# EAGLE design esp-lis3dh (EAGLE 8.4.1)
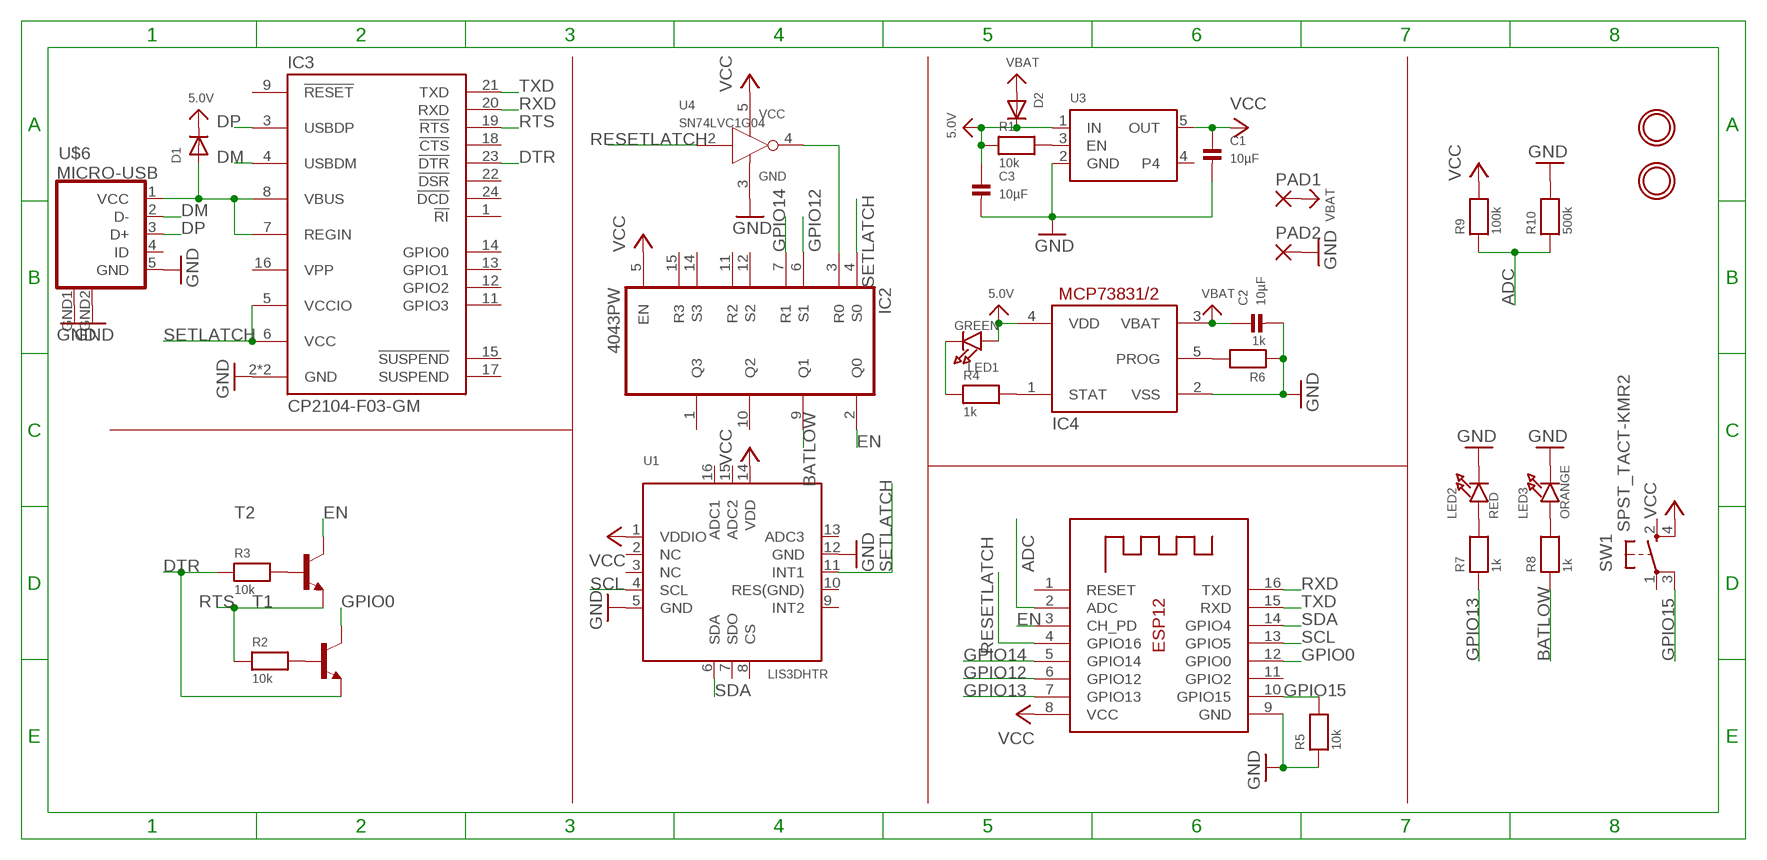
[diagram p0: schematic, sheet 1]

## Parts
C1  10µF  CAP_CERAMIC0805  [0805]
C2  10µF  CAP_CERAMIC0805  [0805]
C3  10µF  CAP_CERAMIC0805  [0805]
D1  DIODESOD-123  [SOD-123]
D2  DIODESOD-123  [SOD-123]
IC2  4043PW  [TSSOP16]
IC3  CP2104-F03-GM  [QFN24-PAD]
IC4  MCP73831/OT  [SOT23-5L]
LED1  GREEN  LED0805  [CHIPLED_0805]
LED2  RED  LED0805  [CHIPLED_0805]
LED3  ORANGE  LED0805  [CHIPLED_0805]
PAD1  SMD2  [SMD1,27-2,54]
PAD2  SMD2  [SMD1,27-2,54]
R1  10k  RESISTOR0603  [0603]
R2  10k  RESISTOR0603  [0603]
R3  10k  RESISTOR0603  [0603]
R4  1k  RESISTOR0603  [0603]
R5  10k  RESISTOR0603  [0603]
R6  1k  RESISTOR0603  [0603]
R7  1k  RESISTOR0603  [0603]
R8  1k  RESISTOR0603  [0603]
R9  100k  RESISTOR0603  [0603]
R10  500k  RESISTOR0603  [0603]
SW1  SPST_TACT-KMR2  [KMR2]
T1  MMBT2222ALT1-NPN-SOT23-BEC  [SOT23-BEC]
T2  MMBT2222ALT1-NPN-SOT23-BEC  [SOT23-BEC]
U1  LIS3DHTR  ACCEL_LIS3DHTR  [LGA16_3X3MM]
U3  VREG_SOT23-5  [SOT23-5]
U4  SN74LVC1G04  [SOT23-5]
U$6  MICRO-USB  [MICRO-USB]
U$7  MOUNTINGHOLE2.5  [MOUNTINGHOLE_2.5_PLATED]
U$8  MOUNTINGHOLE2.5  [MOUNTINGHOLE_2.5_PLATED]
X1  ESP-12  [ESP-12]

## Nets
5.0V: C3.1 D1.C D2.C IC4.4(VDD) LED1.A R1.1 U3.1(IN)
ADC: R9.1 R10.1 X1.2(ADC)
BATLOW: IC2.9(Q1) R8.1
DM: IC3.4(USBDM) U$6.2(D-)
DP: IC3.3(USBDP) U$6.3(D+)
DTR: IC3.23(!DTR) R3.1 T1.E
EN: IC2.2(Q0) T2.C X1.3(CH_PD)
GND: C1.2 C2.2 C3.2 IC3.2(GND) IC3.TP(GND) IC4.2(VSS) LED2.C LED3.C PAD2.1(P) R5.1 R6.1 R10.2 U1.5(GND) U1.12(GND) U3.2(GND) U4.3(GND) U$6.5(GND) U$6.GND1(GND) U$6.GND2(GND) X1.9(GND)
GPIO0: T1.C X1.12(GPIO0)
GPIO12: IC2.6(S1) X1.6(GPIO12)
GPIO13: R7.1 X1.7(GPIO13)
GPIO14: IC2.7(R1) X1.5(GPIO14)
GPIO15: R5.2 SW1.3(P1) X1.10(GPIO15)
N$1: IC2.3(R0) U4.4(Y)
N$2: IC4.5(PROG) R6.2
N$3: LED2.A R7.2
N$4: R1.2 U3.3(EN)
N$5: R2.2 T1.B
N$6: IC4.1(STAT) R4.2
N$7: LED3.A R8.2
N$8: LED1.C R4.1
N$9: R3.2 T2.B
N$10: D1.A IC3.7(REGIN) IC3.8(VBUS) U$6.1(VCC)
RESETLATCH: U4.2(A) X1.4(GPIO16)
RTS: IC3.19(!RTS) R2.1 T2.E
RXD: IC3.20(RXD) X1.16(TXD)
SCL: U1.4(SCL) X1.13(GPIO5)
SDA: U1.6(SDA) X1.14(GPIO4)
SETLATCH: IC2.4(S0) IC3.5(VCCIO) IC3.6(VCC) U1.11(INT1)
TXD: IC3.21(TXD) X1.15(RXD)
VBAT: C2.1 D2.A IC4.3(VBAT) PAD1.1(P)
VCC: C1.1 IC2.5(EN) R9.2 SW1.4(S1) U1.1(VDDIO) U1.14(VDD) U3.5(OUT) U4.5(VCC) X1.8(VCC)
Unconnected: IC2.1(Q3) IC2.10(Q2) IC2.11(R2) IC2.12(S2) IC2.14(S3) IC2.15(R3) IC3.1(!RI) IC3.9(!RESET) IC3.11(GPIO3) IC3.12(GPIO2) IC3.13(GPIO1) IC3.14(GPIO0) IC3.15(!SUSPEND) IC3.17(SUSPEND) IC3.18(!CTS) IC3.22(!DSR) IC3.24(!DCD) SW1.1(P) SW1.2(S) U1.2(NC) U1.3(NC) U1.7(SDO) U1.8(CS) U1.9(INT2) U1.10(RES(GND)) U1.13(ADC3) U1.15(ADC2) U1.16(ADC1) U3.4 U$6.4(ID) X1.1(RESET) X1.11(GPIO2)

## Power pins joined to a net without a drawn wire
VCC: IC2.16(VDD)
VPP: IC3.16(VPP)
VSS: IC2.8(VSS)

## Library data of the parts
C1-C3 = microbuilder:CAP_CERAMIC: Ceramic Capacitors 0402 - 0402 Surface Mount Capacitors 16pF 50V 5% [Digikey: 445-4899-2-ND] 18pF 50V 5% [Digikey: 490-1281-2-ND] 22pF 50V 5% [Digikey: 490-1283-2-ND] 68pF 50V 5% [Digikey: 490-1289-2-ND] 0.1uF 10V 10% [Digikey: 490-1318-2-ND] 1.0uF 6.3V 10% [Digikey: 490-1320-2-ND] 0603 - 0603 Surface Mount Capacitors 16 pF 50V 5% [Digikey: 445-5051-2-ND] 22 pF 50V [Digikey: PCC220ACVTR-ND] 33 pF 50V 5% [Digikey: 490-1415-1-ND] 56pF 50V 5% [Digikey: 490-1421-1-ND] 220pF 50V 5% [Digikey: 445-1285-1-ND] 680 pF 50V 2200 pF 50V 5% C0G [Digikey: 445-1297-1-ND] 5600 pF 100V 5% X7R [Digikey: 478-3711-1-ND] 0.1 µF 25V 10% [Digikey: PCC2277TR-ND] 0.22 µF 16V 10% X7R [Digikey: 445-1318-1-ND] 1.0 µF 25V 10% [Digikey: 445-5146-2-ND] 0603 - RF Specific 3pF 250V +/-0.1pF RF [Digikey: 712-1347-1-ND] 18 pF 250V 5% [Digikey: 478-3505-1-ND or 712-1322-1-ND] 56 pF 250V 5% C0G RF [Digikey: 490-4867-1-ND] 68 pF 250V RF [Digikey: 490-4868-1-ND] 0805 - 0805 Surface Mount Capacitors 220 pF 250V 2% RF Ceramic Capacitor [Digikey: 712-1398-1-ND] 1000 pF 50V 2% NP0 Ceramic Capacitor [Digikey: 478-3760-1-ND] 0.1 µF 25V 10% Ceramic Capacitor [Digikey: PCC1828TR-ND] 1.0 µF 16V 10% Ceramic Capacitor[Digikey: 490-1691-2-ND] 10.0 µF 10V 10% Ceramic Capacitor[Digikey: 709-1228-1-ND] 10.0 uF 16V 10% Ceramic Capacitor [Digikey: 478-5165-2-ND] 47 uF 6.3V 20% Ceramic Capacitor [Digikey: 587-1779-1-ND or 399-5506-1-ND] 1206 - 1206 Surface Mount Capacitors 47uF 10V 20% Ceramic Capacitor [Digikey: 490-5528-1-ND or 399-5508-1-ND or 445-6010-1-ND] 100uF 6.3V -20%, +80% Y5V Ceramic Capacitor (Digikey: 490-4512-1-ND, Mouser: 81-GRM31CF50J107ZE1L)
D1 D2 = microbuilder:DIODE: Diode SMA Model Volts Amps Type Vf Vr Digikey # Notes SSA34-E3 40V 3A Schottky 480mV @ 3A 200uA @ 40V SSA34-E3/61TGITR-ND CDBA120-G 20V 1A Schottky 500mV @ 1A 500uA @ 20V 641-1014-6-ND REEL MBRA210 10V 2A Schottky 350mV @ 2A 700uA @ 10V MBRA210LT3 SOD-123 Model Volts Amps Type Vf Vr Order # Notes BAT54T1G 30V 200mA Schottky 800mV @ 200mA 2uA @ 25V BAT54T1GOSTR-ND B0530W 30V 500mA Schottky 430mV @ 500mA 130uA @ 30V B0530W-FDICT-ND REEL MBR120 1A 20V Schottky 340mV @ 1A MBR120VLSFT1GOSCT-ND SOD-323 Model Volts Amps Type Vf Vr Order # Notes PMEG2005EJ 20V 500mA Schottky 355mV @ 500mA 568-4110-1-ND ZLLS410 10V 570mA Schottky 380mV @ 570mA ZLLS410CT-ND 1N4148WS 75V 150mA Silicon/Simple 1V 1N4148WSFSCT-ND REEL SOD-523 Model Volts Amps Type Vf Vr Order # Notes BAT54XV2 30V 200mA Schottky 0.8V @ 100mA BAT54XV2CT-ND TB751S 30V 30mA Schottky RB751S-40TE61CT-ND SOT23-R/W (R = Solder Paste/Reflow Ovens, W = Hand-Soldering) Model Volts Amps Type Vf Vr Order # Notes BAT54FILM 40V 300mA Schottky 497-7162-1-ND
IC2 = masterthesis:4043: Quad 3-state NOR R/S LATCH
IC3 = CP2104:CP2104: Silabs CP2104 USB to UART Bridge; AVAILABILITY: Unavailable; DESCRIPTION: USB to UART Bridge; MF: Silicon Labs; MP: CP2104; PACKAGE: None; PRICE: None
IC4 = adafruit:MCP73831: MCP73831/2 Miniature Single-Cell, Fully Integrated Li-Ion, Li-Polymer Charge Management Controllers. Nice and small simple lipoly charge controller, with adjustable current and status output (LED) http://www.ladyada.net/library/pcb/eaglelibrary.html
LED1-LED3 = microbuilder:LED: LED 0603 - 0603 Surface Mount Package 2mA: Green LED - Low Power (3.9mcd, 2ma, 1.7Vf) - Digikey: 475-2709-2-ND Orange LED - Low Power (9.8mcd, 2ma, 1.8Vf) - Digikey: 475-1194-2-ND Red LED - Low Power (5mcd, 2ma, 1.8Vf) - Digikey: 475-1195-2-ND Yellow LED - Low Power (7mcd, 2ma, 1.8Vf) - Digikey: 475-1196-2-ND 5mA: Blue LED - Low Power (17mcd, 5ma, 2.9Vf) - Digikey: LNJ937W8CRACT-ND 0805 - 0805 Surface Mount Package 2mA: Red LED (8.8mcd, 2mA, 1.8Vf, Clear) - Low Power [Digikey: 475-2510-1-ND] Green LED (5mcd, 2mA, 1.8Vf, Clear) - Low Power [Digikey: 475-2730-1-ND] Yellow LED (11.3mcd, 2mA, 1.8Vf, Clear) - Low Power [Digikey: 475-2555-1-ND] 20mA: Red LED (104mcd, 20mA, Diffused) - LS R976 [Digikey: 475-1278-6-ND] Red LED (12mcd, 20mA, 2.0Vf, Clear) - APT2012EC [Digikey: 754-1128-1-ND] Green LED (15mcd, 20mA, 2.2Vf, Clear) - APT2012GC [Digikey: 754-1131-1-ND] Orange LED (160mcd, 20mA, 2.1Vf, Clear) - APT2012SECK [Digikey: 754-1130-1-ND] 1206 - 1206 Surface Mount Package Green LED (26mcd, 20mA, Diffused) - LG N971 [Digikey: 475-1407-6-ND] Red LED (15mcd, 20mA, Diffused) - LH N974 [Digikey: 475-1416-6-ND]
PAD1 PAD2 = wirepad:SMD2: SMD PAD
R1-R10 = microbuilder:RESISTOR: Resistors 0402 - 0402 Surface Mount Package 22 Ohm 1% 1/16W [Digikey: 311-22.0LRTR-ND] 33 Ohm 5% 1/16W 1.0K 5% 1/16W 1.5K 5% 1/16W 2.0K 1% 1/16W 10.0K 1% 1/16W [Digikey: 311-10.0KLRTR-ND] 10.0K 5% 1/16W [Digikey: RMCF0402JT10K0TR-ND] 12.1K 1% 1/16W [Digikey: 311-22.0LRTR-ND] 100.0K 5% 1/16W 0603 - 0603 Surface Mount Package 0 Ohm 1/10 Watt 1% Resistor 15 Ohm 1/10 Watt 1% Resistor 33 Ohm 1/10 Watt 1% Resistor 49.9 Ohm 1/10 Watt 1% Resistor 100 Ohm 1/10 Watt 1% Resistor 150 Ohm 1/10 Watt 1% Resistor 240 Ohm 1/10 Watt 1% Resistor 390 Ohm 1/10 Watt 1% Resistor 560 Ohm 1/10 Watt 1% Resistor 680 Ohm 1/10 Watt 1% Resistor 750 Ohm 1/10 Watt 1% Resistor 1.0K Ohm 1/10 Watt 1% Resistor 1.5K Ohm 1/10 Watt 1% Resistor 2.0K Ohm 1/10 Watt 1% Resistor 2.2K Ohm 1/10 Watt 1% Resistor 3.3K Ohm 1/10 Watt 1% Resistor 4.7K Ohm 1/10 Watt 1% Resistor 10.0K Ohm 1/10 Watt 1% Resistor 12.0K Ohm 1/10 Watt 1% Resistor 12.1K Ohm 1/10 Watt 1% Resistor 20.0K Ohm 1/10 Watt 1% Resistor 33.0K Ohm 1/10 Watt 1% Resistor 100.0K Ohm 1/10 Watt 1% Resistor 0805 - 0805 Surface Mount Package 0 Ohm 1/8 Watt 1% Resistor 33 Ohm 1/8 Watt 1% Resistor 100 Ohm 1/8 Watt 1% Resistor 150 Ohm 1/8 Watt 1% Resistor 200 Ohm 1/8 Watt 1% Resistor 240 Ohm 1/8 Watt 1% Resistor 330 Ohm 1/8 Watt 1% Resistor 390 Ohm 1/8 Watt 1% Resistor 470 Ohm 1/8 Watt 1% Resistor 1.0K Ohm 1/8 Watt 1% Resistor 1.5K Ohm 1/8 Watt 1% Resistor 2.0K Ohm 1/8 Watt 1% Resistor 4.7K Ohm 1/8 Watt 1% Resistor 5.1K Ohm 1/8 Watt 1% Resistor 5.6K Ohm 1/8 Watt 1% Resistor 10.0K Ohm 1/8 Watt 1% Resistor 22.0K Ohm 1/8 Watt 1% Resistor 33.0K Ohm 1/8 Watt 1% Resistor 100K Ohm 1/8 Watt 1% Resistor 1206 - 1206 Surface Mount Package 2012 - 2010 Surface Mount Package 0.11 Ohm 1/2 Watt 1% Resistor - Digikey: RHM.11UCT-ND
SW1 = adafruit:SPST_TACT: SMT 6mm switch, EVQQ2 series http://www.ladyada.net/library/eagle
T1 T2 = transistor:*-NPN-: NPN Transistror BF959 corrected 2008.03.06
U1 = microbuilder:ACCEL_LIS3DHTR: LIS3DHTR 3-Axis Accelerometer with I2C/SPI Interface VDD: 1.71-3.6V VDDIO: 1.71-VDD+0.1V Scale: +/-2g, 4g, 8g, 16g with 16--bit data output Temp:: -40°C - 85°C Mouser: 511-LIS3DHTR Digikey: 497-10613-1-ND
U3 = microbuilder:VREG_SOT23-5: SOT23-5 Fixed Voltage Regulators To better organise some of the SOT23-5 fixed voltage regulators in this library, this new part was created. Part Current Out V Out V In V Dropout Digikey Part No. ADP121 150mA 3.3V 3.4-5.5V 0.09V @ 150mA ADP121-AUJZ33R7CT-ND ADP121 150mA 3.0V 3.1-5.5V 0.09V @ 150mA ADP121-AUJZ30R7CT-ND ADP122 300mA 3.3V 3.4-5.5V 0.085V @ 300mA ADP122AUJZ-3.3-R7CT-ND ADP1712 300mA 3.3V 3.5-5.5V 0.17V @ 300mA ADP1712AUJZ-3.3-R7TR-ND AP7311 (Low Cost) 150mA 3.3V 3.5-6V 0.15V @ 150mA AP7311-33WG-7DICT-ND LD39015M18R 150mA 1.8V 1.9V-5.5V 0.08V @ 100mA 497-6977-1-ND MCP1824T-3302E/OT 300mA 3.3V 3.5V-6V 0.2V @ 300mA MCP1824T-3302E/OTCT-ND MIC5205-2.5YM5 TR 150mA 2.5V 2.7-16V 0.165V @ 150mA 576-1257-2-ND MIC5205-3.0YM5 TR 150mA 3.0V 3.2V-16V 0.165V @ 150mA 576-1258-2-ND MIC5205-3.3YM5 TR 150mA 3.3V 3.5V-16V 0.165V @ 150mA 576-1259-2-ND TPS780330220 150mA 3.3V+2.2V 3.6-5.5V 250mV Max 296-23332-1-ND TDA3663/N1,135 100mA 3.3V 3.5-45V 0.18V @ 50mA 568-5343-1-ND
U4 = epic:SN74LVC1G04
U$6 = microusb:MICRO-USB: Micro USB B connector
U$7 U$8 = microbuilder:MOUNTINGHOLE: Mounting Hole For #2 screws (0.086"/2.18mm width, 0.094"/2.4mm hole) use 2.5mm
X1 = adafruit:ESP-12

## Net classes
0 default: width 0.305 mm, drill 0.508 mm, clearance 0.254 mm

## Board
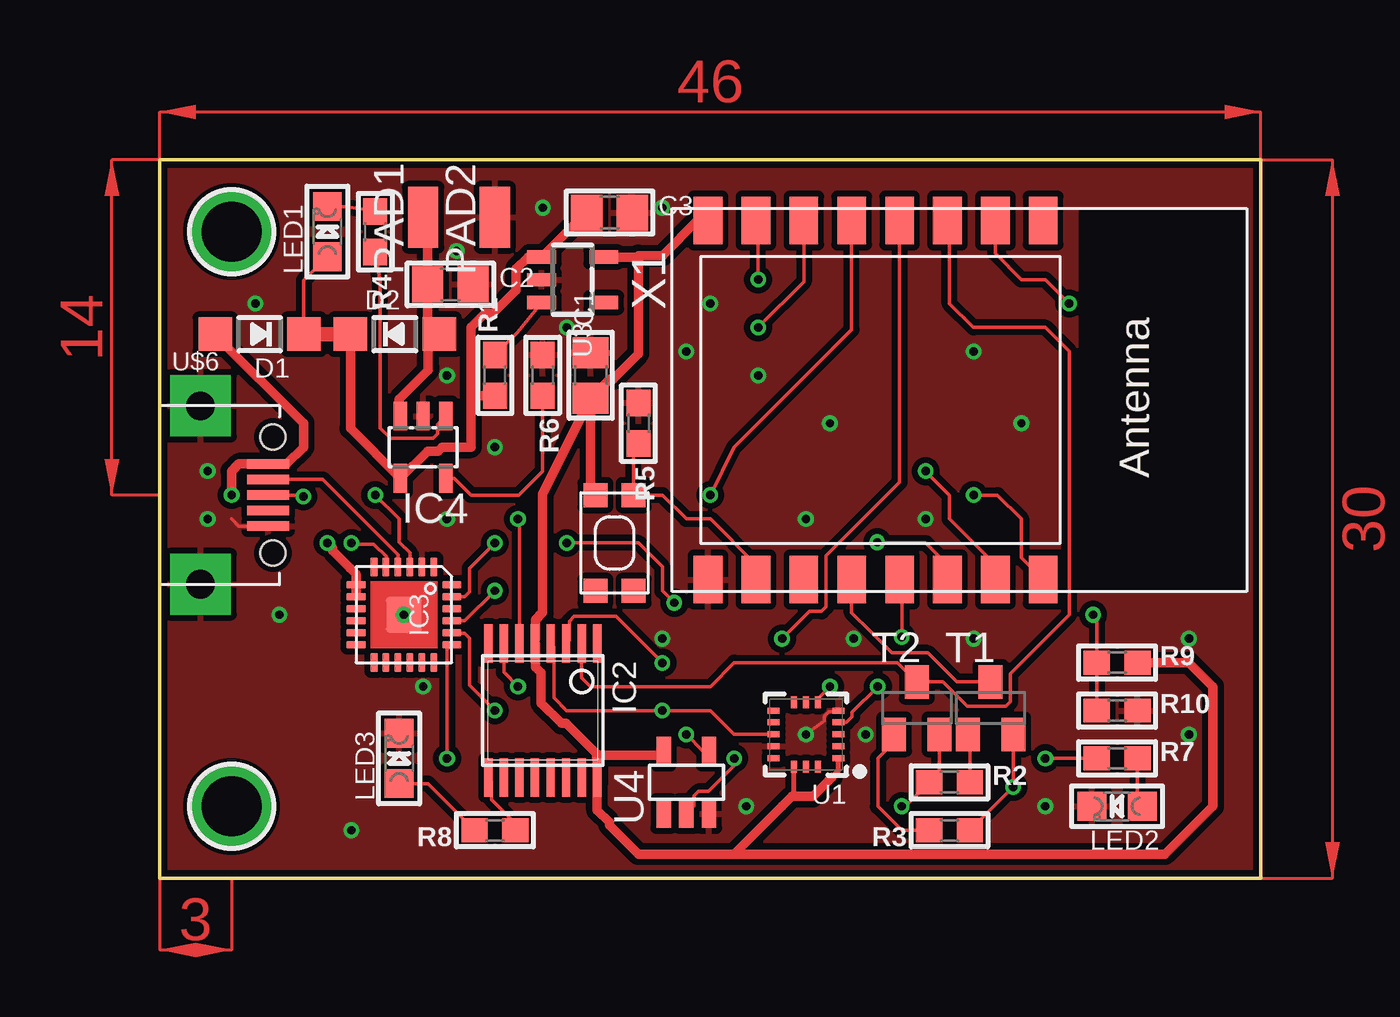
[diagram p1: board, top side]
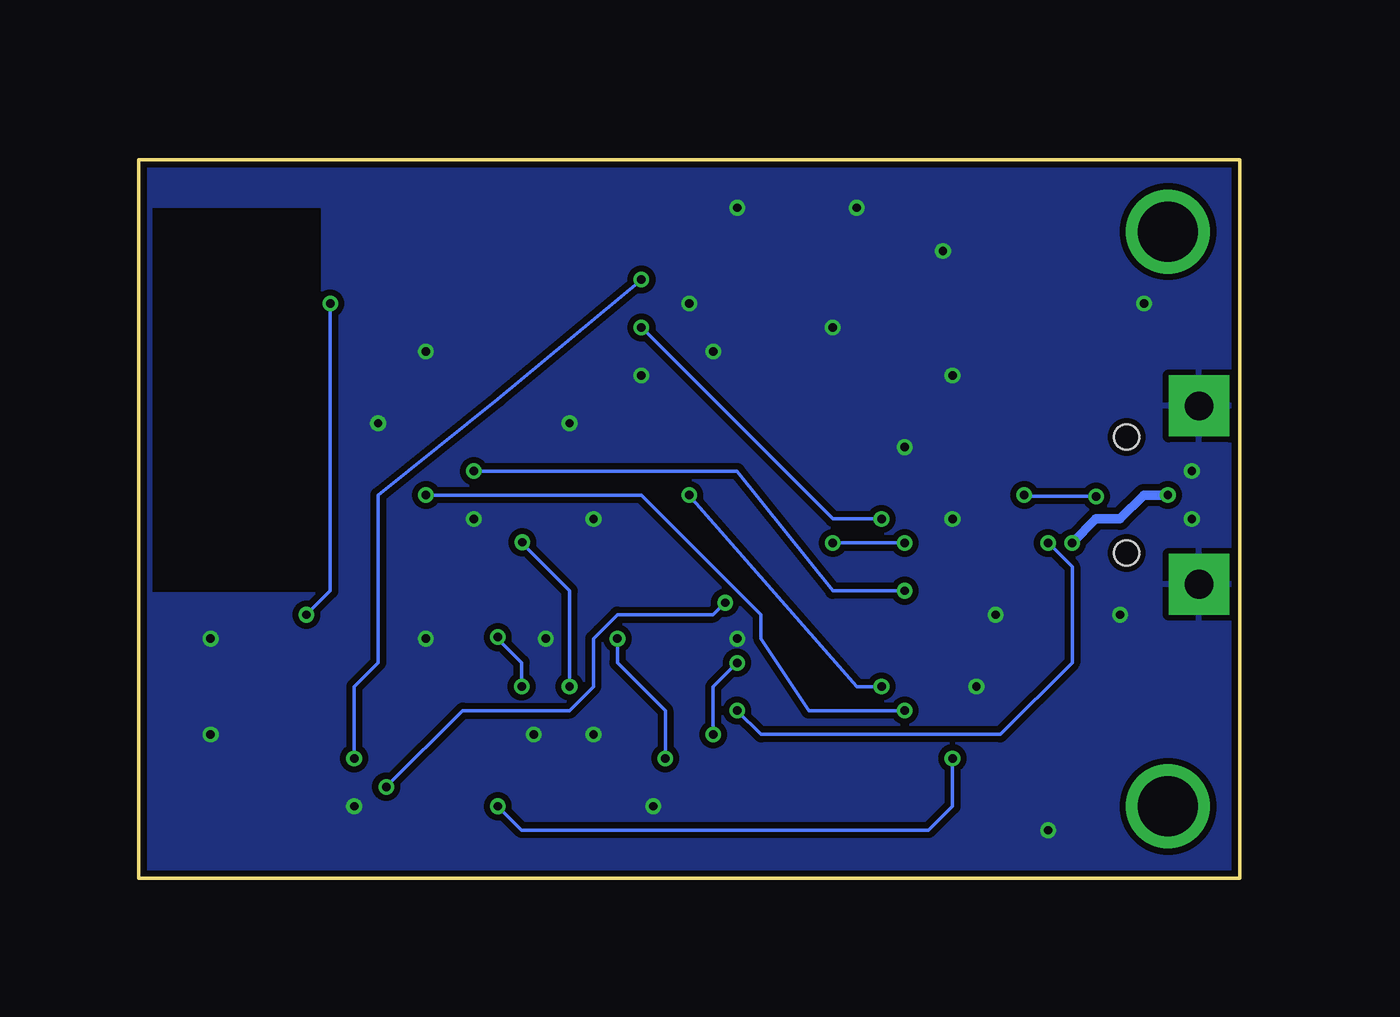
[diagram p2: board, bottom side, seen from below]

Size 46 x 30 mm. Coordinates in mm from the lower left corner, seen from the top.
Outline: 0,0 0,30 46,30 46,0 0,0
Copper layers (1*16): Top 0.035mm / dielectric 1.5mm / Bottom 0.035mm
Design rules "SeeedStudio_2layer_DRU_no_angle_20140221": minimum track width 6mil, minimum drill 12mil, track to track 6mil, track to pad 6mil, pad to pad 6mil, via to via 6mil, smd to smd 0mil, copper to edge 10mil, drill to drill 10mil, minimum pad ring 10mil, minimum via ring 6mil, stop-mask expansion 2mil, vias tented up to drill 100mil, thermal gap 10mil

### Footprints (pad centres in the part's own frame; a part is rotated, then mirrored left to right if it is on the bottom)
0805 = smd 1.3 x 1.5: 1 -0.95,0; 2 0.95,0
SOD-123 = smd 1.4 x 1.4: A 1.85,0; C -1.85,0
TSSOP16 = smd 0.35 x 1.6: 1 -2.275,-2.8; 2 -1.625,-2.8; 3 -0.975,-2.8; 4 -0.325,-2.8; 5 0.325,-2.8; 6 0.975,-2.8; 7 1.625,-2.8; 8 2.275,-2.8; 9 2.275,2.8; 10 1.625,2.8; 11 0.975,2.8; 12 0.325,2.8; 13 -0.325,2.8; 14 -0.975,2.8; 15 -1.625,2.8; 16 -2.275,2.8
QFN24-PAD = smd 0.8 x 0.3: 1 -2,1.25; 2 -2,0.75; 3 -2,0.25; 4 -2,-0.25; 5 -2,-0.75; 6 -2,-1.25; 13 2,-1.25; 14 2,-0.75; 15 2,-0.25; 16 2,0.25; 17 2,0.75; 18 2,1.25 | smd 0.3 x 0.8: 7 -1.25,-2; 8 -0.75,-2; 9 -0.25,-2; 10 0.25,-2; 11 0.75,-2; 12 1.25,-2; 19 1.25,2; 20 0.75,2; 21 0.25,2; 22 -0.25,2; 23 -0.75,2; 24 -1.25,2 | smd 1.5 x 1.5: TP 0,0
SOT23-5L = smd 0.55 x 1.2: 1 -0.95,-1.3; 2 0,-1.3; 3 0.95,-1.3; 4 0.95,1.3; 5 -0.95,1.3
CHIPLED_0805 = smd 1.2 x 1.2: A 0,-1.05; C 0,1.05
SMD1,27-2,54 = smd 1.27 x 2.54: 1 0,0
0603 = smd 1.1 x 1: 1 -0.85,0; 2 0.85,0
KMR2 = smd 1 x 1: 1 2,0.8; 2 2,-0.8; 3 -2,0.8; 4 -2,-0.8
SOT23-BEC = smd 1 x 1.4: B -0.95,-1.1; C 0,1.1; E 0.95,-1.1
LGA16_3X3MM = smd 0.5 x 0.25: 1 -1.35,1; 2 -1.35,0.5; 3 -1.35,0; 4 -1.35,-0.5; 5 -1.35,-1; 9 1.35,-1; 10 1.35,-0.5; 11 1.35,0; 12 1.35,0.5; 13 1.35,1 | smd 0.25 x 0.5: 6 -0.5,-1.35; 7 0,-1.35; 8 0.5,-1.35; 14 0.5,1.35; 15 0,1.35; 16 -0.5,1.35
SOT23-5 = smd 0.55 x 1.2: 1 -0.95,-1.3; 2 0,-1.3; 3 0.95,-1.3; 4 0.95,1.3; 5 -0.95,1.3
SOT23-5' = smd 0.6 x 1.2: 1 -0.95,-1.306; 2 0,-1.306; 3 0.95,-1.306; 4 0.95,1.306; 5 -0.95,1.306
MICRO-USB = smd 0.4 x 1.75: 1 -1.3,4.525; 2 -0.65,4.525; 3 0,4.525; 4 0.65,4.525; 5 1.3,4.525 | drill 1.2 pad 2.54 square: GND1 -3.725,1.7; GND2 3.725,1.7 | hole 1.05: -2.425,4.73; 2.425,4.73
MOUNTINGHOLE_2.5_PLATED = drill 2.5 pad 3.2: P$1 0,0
ESP-12 = smd 2 x 1.2: 1 -7.5,4.5; 2 -7.5,2.5; 3 -7.5,0.5; 4 -7.5,-1.5; 5 -7.5,-3.5; 6 -7.5,-5.5; 7 -7.5,-7.5; 8 -7.5,-9.5; 9 7.5,-9.5; 10 7.5,-7.5; 11 7.5,-5.5; 12 7.5,-3.5; 13 7.5,-1.5; 14 7.5,0.5; 15 7.5,2.5; 16 7.5,4.5

### Placement (x,y rotation side)
C1  18,21 90 top
C2  12.14,24.8 0 top
C3  18.79,27.8 0 top
D1  4.17,22.72 180 top
D2  9.82,22.72 0 top
IC2  16,7 180 top
IC3  10.2,11 270 top
IC4  11,18 180 top
LED1  7,27 0 top
LED2  40,3 90 top
LED3  10,5 0 top
PAD1  11,27.6 0 top
PAD2  14,27.6 0 top
R1  14,21 90 top
R2  33,4 0 top
R3  33,2 180 top
R4  9,27 270 top
R5  20,19 270 top
R6  16,21 270 top
R7  40,5 0 top
R8  14,2 180 top
R9  40,9 0 top
R10  40,7 0 top
SW1  19,14 270 top
T1  34.71,7.1 0 top
T2  31.63,7.1 0 top
U1  27,6 180 top
U3  17.25,24.99 270 top
U4  SN74LVC1G04  [SOT23-5']  22,4 0 top
U$6  0,16 270 top
U$7  3,27 0 top
U$8  3,3 0 top
X1  32.41,19.97 270 top

### Tracks (layer width: path | path; a pad name or v marks a point on that pad's centre or on a via)
5.0V
  Top 0.152: 7.02,25.93 LED1.A 6.02,24.97 D1.C
  Top 0.406: D2.C 7.97,18.78 IC4.4 11.19,17.84 11.63,17.84 11.8,18 13,18 13,20 | 13,20 13,23 13.59,23.59 13.93,23.59 14.89,24.56 14.89,25.45 15.38,25.94 U3.1 17.81,27.8 C3.1 | 13,20 13.15,20.15 R1.1
  Top 0.61: D1.C D2.C
ADC  (via drill 0.35)
  Top 0.152: R10.1 R9.1 39.15,10.85 v39,11 | v38,24 37,25 36,25 34.91,26.09 X1.2
  Bottom 0.152: v38,24 38,12 v39,11
BATLOW
  Top 0.152: IC2.9 13.87,4.05 13.87,3.26 14.85,2.28 R8.1
DM
  Top 0.152: IC3.4 9.95,13.51 6.81,16.65 U$6.2
DP  (via drill 0.35)
  Top 0.152: U$6.3 6,16 v6,15.94 | v9,16 10,15 10,14.03 10.45,13.58 IC3.3
  Bottom 0.152: v6,15.94 8.94,15.94 v9,16
DTR  (via drill 0.35)
  Top 0.152: R3.1 v35.66,3.81 T1.E | v21.5,11.5 21,12 21,13 20,14 v17,14 | v14,14 12.95,12.95 12.95,11.97 12.74,11.76 12.24,11.76 IC3.23
  Bottom 0.152: v35.66,3.81 32.47,7 28,7 27.71,7.29 27.29,7.71 27,8 27,10 26.71,10.29 26,11 22,11 v21.5,11.5 | v17,14 v14,14
EN
  Top 0.152: IC2.2 17.62,8.38 18,8 23,8 24,9 30.83,9 T2.C 32.72,8.2 33.75,7.17 35.35,7.17 35.54,7.36 35.54,8.54 38,11 38,22 37,23 34,23 33,24 33,27.38 X1.3
GND  (via drill 0.35)
  Top 0.152: U$6.5 3.3,14.7 3,15 | U1.5 28.29,6.96 27.96,6.96 27.77,6.76 27.77,6.57 v27,6
  other vias: 12.4,26.2 12,21 21,10 25,21 34,22 4,24 28,19 36,19 5,11 11,8 14,18 12,15 43,10 43,6 37,3 8,2 34,10 32,15 27,15 29.5,6 29,10 2,17 2,15 16,28 21,28 24.5,3 10.2,11 17,23 22,22 23,24
  pour Bottom: -1,31 -1,-1 47,-1 47,31
  pour Top: -1,31 47,31 47,-1 -1,-1
GPIO0
  Top 0.152: T1.C 33.3,8.2 32.09,9.41 30.59,9.41 29.71,10.29 28.91,11.09 X1.12
GPIO12  (via drill 0.35)
  Top 0.152: v14.97,15 15.03,14.94 IC2.6 | X1.6 26.91,24.91 v25,23
  Bottom 0.152: v25,23 24.71,22.71 17,15 v14.97,15
GPIO13  (via drill 0.35)
  Top 0.152: v37,5 R7.1 | v25,25 25,27.38 X1.7
  Bottom 0.152: v25,25 31,20 36,16 36,9 37,8 v37,5
GPIO14  (via drill 0.35)
  Top 0.152: v23,16 24,18 28.91,22.91 X1.5 | v14.97,8 14.38,8.59 IC2.7
  Bottom 0.152: v23,16 16,8 v14.97,8
GPIO15
  Top 0.152: 24.84,12.54 X1.10 24.91,13.09 23,15 22,15 21,16 SW1.3 19.8,17.95 R5.2
N$1  (via drill 0.35)
  Top 0.152: IC2.3 17.12,9.95 17.12,10.74 17.31,10.93 19.07,10.93 20.71,9.29 v21,9 v21,8.99 | v22,6 22.69,5.31 U4.4
  Bottom 0.152: v21,8.99 22,7.99 v22,6
N$2
  Top 0.152: IC4.5 12.3,16.7 13,16 15,16 16,17 R6.2
N$3
  Top 0.152: R7.2 40.85,3.2 LED2.A
N$4
  Top 0.152: U3.3 14.95,22.8 R1.2
N$5
  Top 0.152: R2.2 33.85,5.91 T1.B
N$6
  Top 0.152: R4.2 9.21,24.94 9.21,18.8 9.64,18.37 11.41,18.37 11.61,18.56 11.61,18.95 IC4.1
N$7
  Top 0.152: R8.2 11.2,3.95 LED3.A
N$8
  Top 0.152: LED1.C 7.8,28.05 R4.1
N$9
  Top 0.152: T2.B 30.68,5.68 30,5 30,3 31,2 R3.2
N$10  (via drill 0.35)
  Top 0.203: IC3.8 8.2,11.86
  Top 0.406: D1.A 2.32,22.68 6,19 6,18 5.3,17.3 U$6.1 3.3,17.3 3,17 v3,16 | v7,14 7.23,13.77 7.23,13.68 7.95,12.95 | 7.95,12.95 8.2,12.7 | 7.95,12.95 8.2,12.7 | 8.2,12.7 IC3.7 8.2,11.86
  Bottom 0.406: v3,16 4,16 5,15 6,15 v7,14
RESETLATCH  (via drill 0.35)
  Top 0.152: v26,10 27.14,11.14 27.65,11.14 27.84,11.33 27.84,13.47 30.91,16.54 X1.4 | v24,5 24,4.69 22.93,3.62 22.51,3.62 22.32,3.43 22.32,3.01 U4.2
  Bottom 0.152: v26,10 26,9 24,7 v24,5
RTS  (via drill 0.35)
  Top 0.152: IC3.19 12,9.55 v12,5 | v31,3 31.15,3 R2.1 32.58,4.43 T2.E
  Bottom 0.152: v12,5 12,3 13,2 30,2 v31,3
RXD  (via drill 0.35)
  Top 0.152: IC3.20 12.24,10.22 12.74,10.22 12.95,10.01 12.95,8.05 v14,7 | v34,16 35,16 36,15 36,13.38 X1.16
  Bottom 0.152: v14,7 18,7 20,10 20,11 25,16 v34,16
SCL  (via drill 0.35)
  Top 0.152: v30,8 28.93,6.93 28.93,6.74 28.69,6.5 U1.4 | v31,10.06 31,12.38 X1.13
  Bottom 0.152: v30,8 30,9 31,10 v31,10.06
SDA  (via drill 0.35)
  Top 0.152: U1.6 27.5,7.5 v28,8 | v29.97,14.03 30,14 32,14 32.91,13.09 X1.14
  Bottom 0.152: v28,8 28,12 30,14 v29.97,14.03
SETLATCH  (via drill 0.35)
  Top 0.152: U1.11 24,6 23,7 v21,7 17,7 16.47,7.53 16.47,9.65 IC2.4 | v8.01,14 v8,14 8.06,13.94 8.94,13.94 9.47,13.41 IC3.5 IC3.6
  Bottom 0.152: v8.01,14 v8,14 7.29,13.29 7,13 7,9 10,6 20,6 v21,7
TXD  (via drill 0.35)
  Top 0.152: IC3.21 12.74,10.74 v14,12 | v32,17 33,16 33,15 35,13 35,12.56 X1.15
  Bottom 0.152: v14,12 17,12 21,17 v32,17
VBAT
  Top 0.406: PAD1.1 11.19,27.41 C2.1 11.19,23.2 11.2,23.2 | 11.2,23.2 D2.A | 11.21,21.32 11.21,21.21 | 11.21,21.21 10,20 10,19.35 IC4.3 | 11.21,21.21 11.21,23.18 11.2,23.2
VCC
  Top 0.152: 20.88,5.14 U4.5
  Top 0.203: 26,3 26.5,3.5 U1.14 | 27.94,4.06 28.35,4.48 U1.1
  Top 0.406: 18.61,26 U3.5 19.94,25.94 20,26 | C1.1 16,16.05 16,11.1 15.69,10.79 15.69,10 15.68,9.98 IC2.5 15.69,9.78 15.69,8.81 15.94,8.57 15.94,7.31 16.78,6.47 16.98,6.47 18.26,5.19 18.26,5 | 18.26,5 18.27,4.98 IC2.16 | IC2.16 18.27,4 | 18.26,5 18.39,5.14 20.88,5.14 | R9.2 43,9 44,8 44,3 42,1 24,1 | IC2.16 18.27,2.83 18.78,2.32 18.78,2.22 20,1 24,1 | 24,1 26,3 26.42,3.42 27.29,3.42 27.94,4.06 28.08,4.21 | C1.1 18,16.2 SW1.4 | C1.1 18.79,20.84 18.94,20.84 20,21.9 20,26 | 20,26 21,26 22.47,27.47 X1.8
(copper drawn outside any net)
  shapes: Top area x4